# Altium schematic sheet Sheet2.SchDoc
size A4
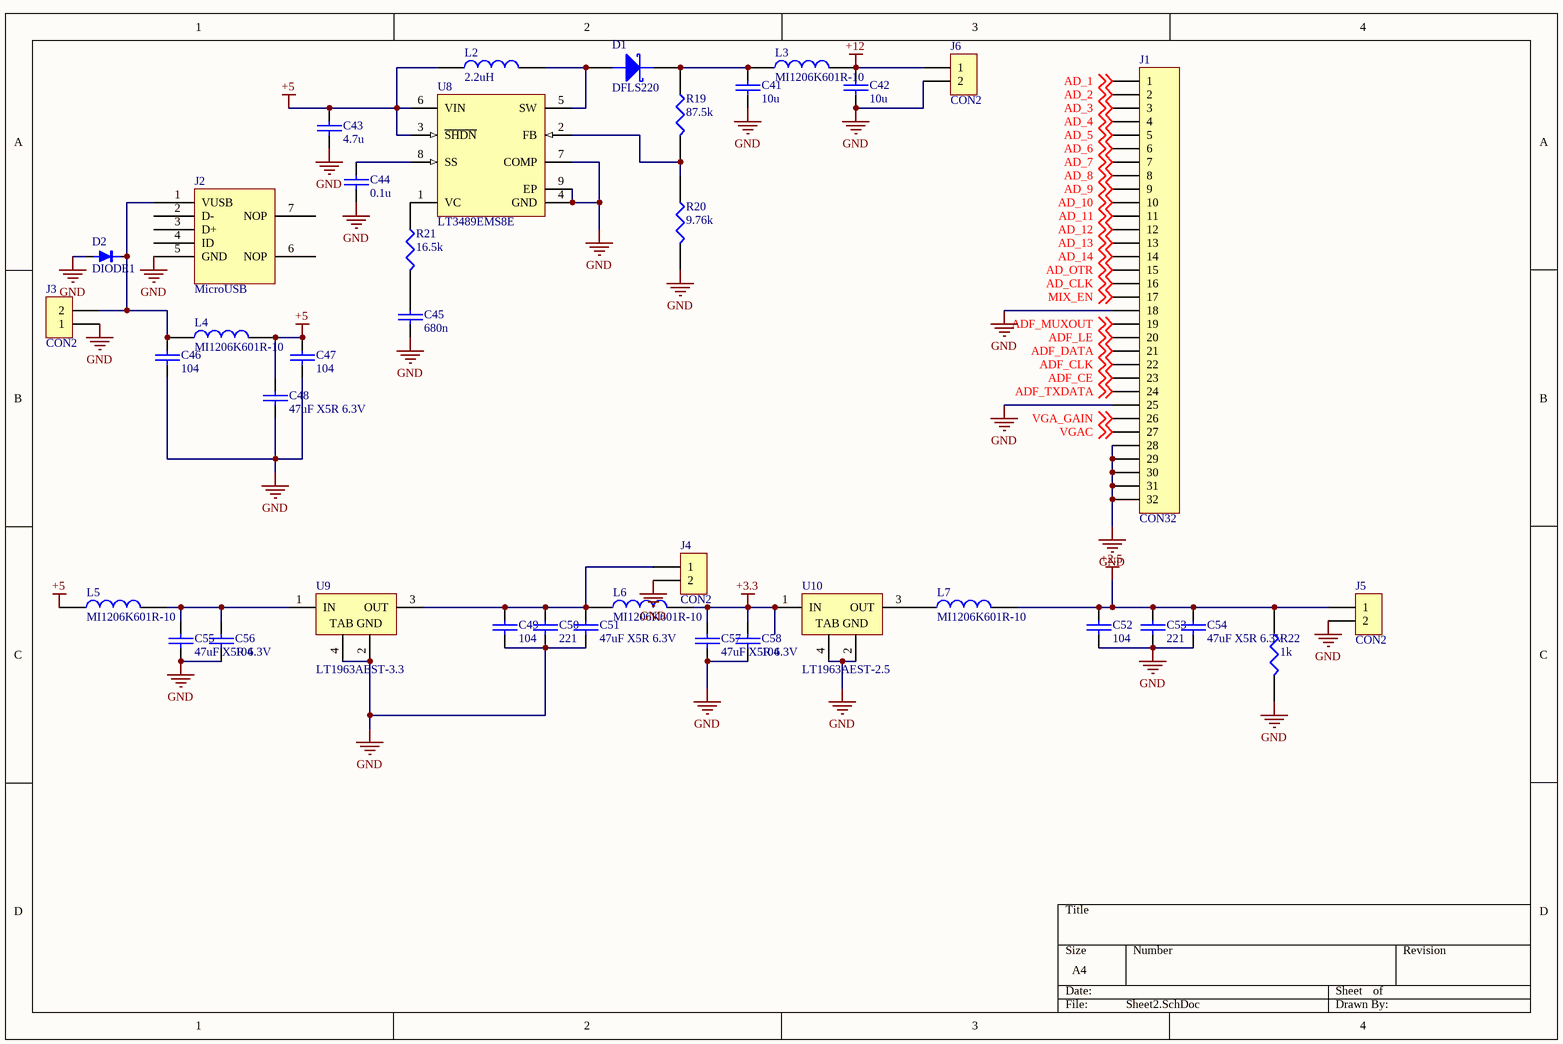
[diagram p0: Sheet2.SchDoc]

## Parts
C41  10u  [0603_R]
C42  10u  [0603_R]
C43  4.7u  [0603_R]
C44  0.1u  [0603_R]
C45  680n  [0603_R]
C46  104  [0603_C]
C47  104  [0603_C]
C48  47uF X5R 6.3V  [CD2012-0805]
C49  104  [0603_R]
C50  221  [0603_R]
C51  47uF X5R 6.3V  [CD2012-0805]
C52  104  [0603_R]
C53  221  [0603_R]
C54  47uF X5R 6.3V  [CD2012-0805]
C55  47uF X5R 6.3V  [CD2012-0805]
C56  104  [0603_R]
C57  47uF X5R 6.3V  [CD2012-0805]
C58  104  [0603_R]
D1  DFLS220  [SOD123]
D2  DIODE1  [DIODE0.4A]
J1  CON32  [CON32]
J2  MicroUSB  [MICRO-USB]
J3  CON2  [SIP2]
J4  CON2  [SIP2]
J5  CON2  [SIP2]
J6  CON2  [SIP2]
L2  2.2uH  [CD4532-1812]
L3  MI1206K601R-10  [1206]
L4  MI1206K601R-10  [1206]
L5  MI1206K601R-10  [1206]
L6  MI1206K601R-10  [1206]
L7  MI1206K601R-10  [1206]
R19  87.5k  [0603_R]
R20  9.76k  [0603_R]
R21  16.5k  [0603_R]
R22  1k  [0603_R]
U8  LT3489EMS8E  [LT-MS8E-8-2060X1830TP_N]
U9  LT1963AEST-3.3  [LT-ST-3-SOT-223_N]
U10  LT1963AEST-2.5  [LT-ST-3-SOT-223_N]

## Nets
+2.5: C52.1 C53.1 C54.1 J5.1 L7.2 R22.1
+3.3: C57.1 C58.1 L6.2 U10.1(IN)
+5: C43.1 C47.1 C48.1 L2.1 L4.2 L5.1 U8.3(~{SHDN}) U8.6(VIN)
+12: C42.1 J6.1 L3.2
GND: C41.2 C42.2 C43.2 C44.2 C45.2 C46.2 C47.2 C48.2 C49.2 C50.2 C51.2 C52.2 C53.2 C54.2 C55.2 C56.2 C57.2 C58.2 D2.A J1.18 J1.25 J1.28 J1.29 J1.30 J1.31 J1.32 J2.5(GND) J3.1 J4.2 J5.2 J6.2 R20.2 R22.2 U8.4(GND) U8.7(COMP) U8.9(EP) U9.2(GND) U9.4(TAB) U10.2(GND) U10.4(TAB)
AD_1: J1.1 ; off-sheet AD_1
AD_2: J1.2 ; off-sheet AD_2
AD_3: J1.3 ; off-sheet AD_3
AD_4: J1.4 ; off-sheet AD_4
AD_5: J1.5 ; off-sheet AD_5
AD_6: J1.6 ; off-sheet AD_6
AD_7: J1.7 ; off-sheet AD_7
AD_8: J1.8 ; off-sheet AD_8
AD_9: J1.9 ; off-sheet AD_9
AD_10: J1.10 ; off-sheet AD_10
AD_11: J1.11 ; off-sheet AD_11
AD_12: J1.12 ; off-sheet AD_12
AD_13: J1.13 ; off-sheet AD_13
AD_14: J1.14 ; off-sheet AD_14
AD_CLK: J1.16 ; off-sheet AD_CLK
AD_OTR: J1.15 ; off-sheet AD_OTR
ADF_CE: J1.23 ; off-sheet ADF_CE
ADF_CLK: J1.22 ; off-sheet ADF_CLK
ADF_DATA: J1.21 ; off-sheet ADF_DATA
ADF_LE: J1.20 ; off-sheet ADF_LE
ADF_MUXOUT: J1.19 ; off-sheet ADF_MUXOUT
ADF_TXDATA: J1.24 ; off-sheet ADF_TXDATA
MIX_EN: J1.17 ; off-sheet MIX_EN
VGA_GAIN: J1.26 ; off-sheet VGA_GAIN
VGAC: J1.27 ; off-sheet VGAC
NetC41_1: C41.1 D1.2(K) L3.1 R19.1
NetC44_1: C44.1 U8.8(SS)
NetC45_1: C45.1 R21.2
NetC46_1: C46.1 D2.K J2.1(VUSB) J3.2 L4.1
NetC49_1: C49.1 C50.1 C51.1 J4.1 L6.1 U9.3(OUT)
NetC55_1: C55.1 C56.1 L5.2 U9.1(IN)
NetD1_1: D1.1(A) L2.2 U8.5(SW)
NetL7_1: L7.1 U10.3(OUT)
NetR19_2: R19.2 R20.1 U8.2(FB)
NetR21_1: R21.1 U8.1(VC)

Not connected (* = marked no-connect by the designer): J2 2(D-) 3(D+) 4(ID) 6(NOP) 7(NOP)

## Library data of the parts
C41-C58 = CAP: Capacitor
D1 = DIODE SCHOTTKY: Schottky Diode
J1 = CON32: Connector
L2-L7 = INDUCTOR
R19-R22 = RES1
U8 = LT3489EMS8E: 2 MHz Boost DC/DC Converter with 2.5 A Switch and Soft-Start, 8-pin SOP (MS8E-8), -40 to 85 degC; Manufacturer: Linear Technology; Number of Outputs: 1; PackageVersion: Rev. E; PackageReference: MS8E-8; PackageDescription: 8-Pin Plastic MSOP, Exposed Die Pad, Body 3 x 3 mm, Pitch 0.65 mm; RoHS: FALSE; Mounting Technology: Surface Mount; PartNumber: LT3489EMS8E; ComponentLink1Description: Manufacturer URL; ComponentLink1URL: http://www.linear.com/; ComponentLink2Description: Datasheet; ComponentLink2URL: http://cds.linear.com/docs/en/datasheet/3489f.pdf; ComponentLink3Description: Package Specification; ComponentLink3URL: http://cds.linear.com/docs/en/datasheet/4070fc.pdf
U9 U10 = LT1963AEST-3.3: 1.5 A, Low Noise, Fast Transient Response LDO Regulator, 2.1 to 20 V Vin, 3.3 V Vout, 3-pin SOT223 (ST-3), -40 to 125 degC; Manufacturer: Linear Technology; Discrete Pass Element: no; Dropout Voltage(V): 0.34; Iout(mA): 1500; Isupply(mA): 1; Noise(uV): 40; Output Voltage: 3.3 V; PSRR(dB): 63; Shutdown Current(uA): 0.01; Vin Max(V): 20; Vin Min(V): 2.1; DatasheetVersion: Rev. E; PackageVersion: Jun-10; PackageReference: ST-3; PackageDescription: 3-Pin Plastic SOT-223, 3.505 x 6.505 mm Body, Pitch 2.3 mm; Supplier 1: Digi-Key; Supplier Part Number 1: LT1963AEST-3.3-ND; Supplier 2: Newark; Supplier Part Number 2: 57M7458; Number of Outputs: 1; RoHS: FALSE; Mounting Technology: Surface Mount; PartNumber: LT1963AEST-3.3; ComponentLink1Description: Manufacturer URL; ComponentLink1URL: http://www.linear.com/; ComponentLink2Description: Datasheet; ComponentLink2URL: http://cds.linear.com/docs/en/datasheet/1963afe.pdf; ComponentLink3Description: Package Specification; ComponentLink3URL: http://cds.linear.com/docs/en/packaging/SOT_3_05-08-1630.pdf